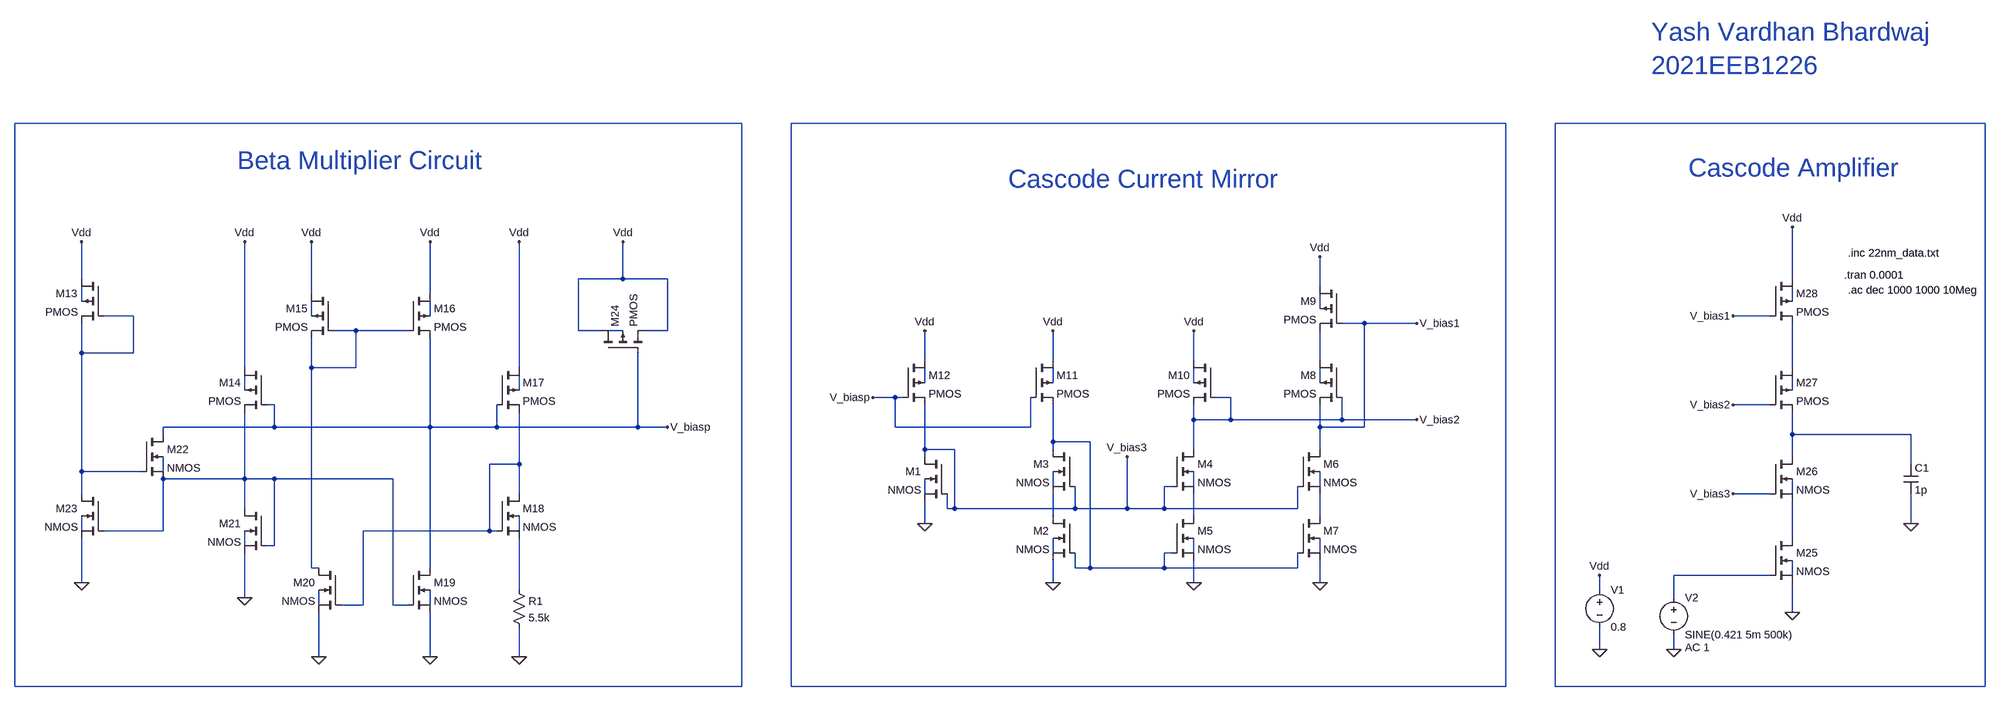
[diagram p0: schematic project_22nm.asc]
project_22nm.asc, the LTspice schematic file:
Version 4
SHEET 1 4568 820
WIRE 32 -400 -1536 -400
WIRE 1904 -400 336 -400
WIRE 3040 -400 2112 -400
WIRE -1392 -64 -1392 -144
WIRE -224 -64 -224 -144
WIRE -224 -64 -320 -64
WIRE -128 -64 -224 -64
WIRE 2624 -64 2624 -176
WIRE 1488 -48 1488 -112
WIRE -896 -32 -896 -144
WIRE -640 -32 -640 -144
WIRE -1392 -16 -1392 -48
WIRE 2624 -16 2624 -48
WIRE 1488 0 1488 -32
WIRE -1280 16 -1344 16
WIRE -896 16 -896 -16
WIRE -640 16 -640 -16
WIRE 2576 16 2496 16
WIRE 1584 32 1536 32
WIRE 1712 32 1584 32
WIRE -800 48 -848 48
WIRE -688 48 -800 48
WIRE -320 48 -320 -64
WIRE -272 48 -320 48
WIRE -224 48 -256 48
WIRE -128 48 -128 -64
WIRE -128 48 -176 48
WIRE -1392 96 -1392 32
WIRE -1280 96 -1280 16
WIRE -1280 96 -1392 96
WIRE 624 112 624 48
WIRE 912 112 912 48
WIRE 1216 112 1216 48
WIRE 1488 112 1488 48
WIRE -1040 128 -1040 -144
WIRE -896 128 -896 64
WIRE -800 128 -800 48
WIRE -800 128 -896 128
WIRE -448 128 -448 -144
WIRE 2624 128 2624 32
WIRE 624 160 624 128
WIRE 912 160 912 128
WIRE 1216 160 1216 128
WIRE 1488 160 1488 128
WIRE -1040 176 -1040 144
WIRE -448 176 -448 144
WIRE 2624 176 2624 144
WIRE 560 192 512 192
WIRE 576 192 560 192
WIRE 1296 192 1264 192
WIRE -976 208 -992 208
WIRE 2576 208 2496 208
WIRE 1216 240 1216 208
WIRE 1296 240 1296 192
WIRE 1296 240 1216 240
WIRE 1536 240 1536 192
WIRE 1536 240 1296 240
WIRE 1712 240 1536 240
WIRE -976 256 -976 208
WIRE -976 256 -1216 256
WIRE -640 256 -640 64
WIRE -640 256 -976 256
WIRE -496 256 -496 208
WIRE -496 256 -640 256
WIRE -192 256 -192 96
WIRE -192 256 -496 256
WIRE -128 256 -192 256
WIRE 560 256 560 192
WIRE 864 256 864 192
WIRE 864 256 560 256
WIRE 1488 256 1488 208
WIRE 1584 256 1584 32
WIRE 1584 256 1488 256
WIRE -1216 272 -1216 256
WIRE 2624 272 2624 224
WIRE 2880 272 2624 272
WIRE 912 288 912 208
WIRE 992 288 912 288
WIRE 624 304 624 208
WIRE 688 304 624 304
WIRE 912 304 912 288
WIRE 1216 304 1216 240
WIRE 1488 304 1488 256
WIRE 624 320 624 304
WIRE 2624 320 2624 272
WIRE -448 336 -448 224
WIRE -448 336 -512 336
WIRE 2880 336 2880 272
WIRE -1392 352 -1392 96
WIRE -1264 352 -1392 352
WIRE -1216 352 -1216 320
WIRE -1040 368 -1040 224
WIRE -1040 368 -1216 368
WIRE -976 368 -1040 368
WIRE -720 368 -976 368
WIRE 912 384 912 352
WIRE 1168 384 1152 384
WIRE 1216 384 1216 352
WIRE 1488 384 1488 352
WIRE -1392 400 -1392 352
WIRE -448 400 -448 336
WIRE 624 400 624 368
WIRE 2576 400 2496 400
WIRE 2624 400 2624 368
WIRE -1040 432 -1040 368
WIRE 672 432 672 400
WIRE 688 432 688 304
WIRE 688 432 672 432
WIRE 960 432 960 384
WIRE 960 432 688 432
WIRE 1072 432 1072 320
WIRE 1072 432 960 432
WIRE 1152 432 1152 384
WIRE 1152 432 1072 432
WIRE 1440 432 1440 384
WIRE 1440 432 1152 432
WIRE 912 448 912 400
WIRE 1216 448 1216 400
WIRE 1488 448 1488 400
WIRE 624 464 624 416
WIRE 2880 464 2880 400
WIRE -1392 480 -1392 448
WIRE -1216 480 -1216 368
WIRE -1216 480 -1344 480
WIRE -512 480 -512 336
WIRE -512 480 -784 480
WIRE -496 480 -512 480
WIRE -448 480 -448 448
WIRE 2624 496 2624 416
WIRE -1040 512 -1040 480
WIRE -976 512 -976 368
WIRE -976 512 -992 512
WIRE 912 528 912 496
WIRE 1168 528 1152 528
WIRE 1216 528 1216 496
WIRE 1488 528 1488 496
WIRE -896 560 -896 128
WIRE -880 560 -896 560
WIRE -640 560 -640 256
WIRE 960 560 960 528
WIRE 992 560 992 288
WIRE 992 560 960 560
WIRE 1152 560 1152 528
WIRE 1152 560 992 560
WIRE 1440 560 1440 528
WIRE 1440 560 1152 560
WIRE 2576 576 2368 576
WIRE 2624 576 2624 544
WIRE -1392 592 -1392 496
WIRE 912 592 912 544
WIRE 1216 592 1216 544
WIRE 1488 592 1488 544
WIRE -448 608 -448 496
WIRE 2208 608 2208 576
WIRE -1040 624 -1040 528
WIRE 2368 624 2368 576
WIRE -880 640 -880 608
WIRE -784 640 -784 480
WIRE -784 640 -832 640
WIRE -720 640 -720 368
WIRE -688 640 -720 640
WIRE -640 640 -640 608
WIRE 2624 656 2624 592
WIRE 2208 736 2208 688
WIRE 2368 736 2368 704
WIRE -880 752 -880 656
WIRE -640 752 -640 656
WIRE -448 752 -448 688
WIRE -1536 816 -1536 -400
WIRE 32 816 32 -400
WIRE 32 816 -1536 816
WIRE 336 816 336 -400
WIRE 1904 816 1904 -400
WIRE 1904 816 336 816
WIRE 2112 816 2112 -400
WIRE 3040 816 3040 -400
WIRE 3040 816 2112 816
FLAG 1488 592 0
FLAG 1216 592 0
FLAG 912 592 0
FLAG 624 464 0
FLAG 2208 736 0
FLAG 2208 576 Vdd
FLAG 624 48 Vdd
FLAG 912 48 Vdd
FLAG 1216 48 Vdd
FLAG 1488 -112 Vdd
FLAG 1712 32 V_bias1
FLAG 1712 240 V_bias2
FLAG 1072 320 V_bias3
FLAG 512 192 V_biasp
FLAG -1392 592 0
FLAG -1040 624 0
FLAG -880 752 0
FLAG -640 752 0
FLAG -448 752 0
FLAG -224 -144 Vdd
FLAG -448 -144 Vdd
FLAG -640 -144 Vdd
FLAG -896 -144 Vdd
FLAG -1040 -144 Vdd
FLAG -1392 -144 Vdd
FLAG -128 256 V_biasp
FLAG 2880 464 0
FLAG 2624 656 0
FLAG 2368 736 0
FLAG 2624 -176 Vdd
FLAG 2496 16 V_bias1
FLAG 2496 208 V_bias2
FLAG 2496 400 V_bias3
SYMBOL nmos4 672 320 M0
SYMATTR InstName M1
SYMATTR Value2 l=44n w=45.1n
SYMBOL nmos4 960 448 M0
SYMATTR InstName M2
SYMATTR Value2 l=22n w=109n
SYMBOL nmos4 960 304 M0
SYMATTR InstName M3
SYMATTR Value2 l=22n w=111n
SYMBOL nmos4 1168 304 R0
SYMATTR InstName M4
SYMATTR Value2 l=22n w=290n
SYMBOL nmos4 1168 448 R0
SYMATTR InstName M5
SYMATTR Value2 l=22n w=179n
SYMBOL nmos4 1440 304 R0
SYMATTR InstName M6
SYMATTR Value2 l=22n w=44n
SYMBOL nmos4 1440 448 R0
SYMATTR InstName M7
SYMATTR Value2 l=22n w=162.696n
SYMBOL pmos4 1536 112 M0
SYMATTR InstName M8
SYMATTR Value2 l=22n w=2200n
SYMBOL pmos4 1536 -48 M0
SYMATTR InstName M9
SYMATTR Value2 l=22n w=264n
SYMBOL pmos4 1264 112 M0
SYMATTR InstName M10
SYMATTR Value2 l=22n w=34n
SYMBOL pmos4 864 112 R0
SYMATTR InstName M11
SYMATTR Value2 l=22n w=264n
SYMBOL pmos4 576 112 R0
SYMATTR InstName M12
SYMATTR Value2 l=22n w=4400n
SYMBOL voltage 2208 592 R0
WINDOW 123 0 0 Left 0
WINDOW 39 0 0 Left 0
SYMATTR InstName V1
SYMATTR Value 0.8
SYMBOL pmos4 -1344 -64 M0
SYMATTR InstName M13
SYMATTR Value2 l=44n w=22n
SYMBOL pmos4 -992 128 M0
SYMATTR InstName M14
SYMATTR Value2 l=22n w=264n
SYMBOL pmos4 -848 -32 M0
SYMATTR InstName M15
SYMATTR Value2 l=22n w=264n
SYMBOL pmos4 -688 -32 R0
SYMATTR InstName M16
SYMATTR Value2 l=22n w=264n
SYMBOL pmos4 -496 128 R0
SYMATTR InstName M17
SYMATTR Value2 l=22n w=264n
SYMBOL nmos4 -496 400 R0
SYMATTR InstName M18
SYMATTR Value2 l=22n w=110n
SYMBOL nmos4 -688 560 R0
SYMATTR InstName M19
SYMATTR Value2 l=22n w=110n
SYMBOL nmos4 -832 560 M0
SYMATTR InstName M20
SYMATTR Value2 l=22n w=110n
SYMBOL nmos4 -992 432 M0
SYMATTR InstName M21
SYMATTR Value2 l=22n w=110n
SYMBOL nmos4 -1264 272 R0
SYMATTR InstName M22
SYMATTR Value2 l=22n w=44n
SYMBOL nmos4 -1344 400 M0
SYMATTR InstName M23
SYMATTR Value2 l=22n w=110n
SYMBOL res -464 592 R0
SYMATTR InstName R1
SYMATTR Value 5.5k
SYMBOL pmos4 -272 96 R270
SYMATTR InstName M24
SYMATTR Value2 l=22n w=22n
SYMBOL nmos4 2576 496 R0
SYMATTR InstName M25
SYMATTR Value2 l=22n w=425n
SYMBOL nmos4 2576 320 R0
SYMATTR InstName M26
SYMATTR Value2 l=132n w=1660n
SYMBOL pmos4 2576 128 R0
SYMATTR InstName M27
SYMATTR Value2 l=44n w=11000n
SYMBOL pmos4 2576 -64 R0
SYMATTR InstName M28
SYMATTR Value2 l=44n w=17000n
SYMBOL cap 2864 400 M180
WINDOW 0 24 56 Left 2
WINDOW 3 24 8 Left 2
SYMATTR InstName C1
SYMATTR Value 1p
SYMBOL voltage 2368 608 R0
WINDOW 123 24 124 Left 2
WINDOW 39 0 0 Left 0
SYMATTR Value2 AC 1
SYMATTR InstName V2
SYMATTR Value SINE(0.421 5m 500k)
TEXT -1056 -320 Left 5 ;Beta Multiplier Circuit
TEXT 816 -280 Left 5 ;Cascode Current Mirror
TEXT 2400 -304 Left 5 ;Cascode Amplifier
TEXT 2744 -120 Left 2 !.inc 22nm_data.txt
TEXT 2736 -72 Left 2 !.tran 0.0001
TEXT 2744 -40 Left 2 !.ac dec 1000 1000 10Meg
TEXT 2320 -656 Left 5 ;Yash Vardhan Bhardwaj\n2021EEB1226

The netlist it stands for:
* project_22nm.asc
M1 V_bias3 V_bias3 0 N029 NMOS l=44n w=45.1n
M2 N031 N022 0 N038 NMOS l=22n w=109n
M3 N022 V_bias3 N031 N026 NMOS l=22n w=111n
M4 V_bias2 V_bias3 N032 N027 NMOS l=22n w=290n
M5 N032 N022 0 N039 NMOS l=22n w=179n
M6 V_bias1 V_bias3 N033 N028 NMOS l=22n w=44n
M7 N033 N022 0 N040 NMOS l=22n w=162.696n
M8 N012 V_bias2 V_bias1 N017 PMOS l=22n w=2200n
M9 Vdd V_bias1 N012 N006 PMOS l=22n w=264n
M10 Vdd V_bias2 V_bias2 N016 PMOS l=22n w=34n
M11 Vdd V_biasp N022 N015 PMOS l=22n w=264n
M12 Vdd V_biasp V_bias3 N014 PMOS l=22n w=4400n
V1 Vdd 0 0.8
M13 Vdd N007 N007 N004 PMOS l=44n w=22n
M14 Vdd V_biasp N025 N018 PMOS l=22n w=264n
M15 Vdd N010 N010 N008 PMOS l=22n w=264n
M16 Vdd N010 V_biasp N009 PMOS l=22n w=264n
M17 Vdd V_biasp N023 N019 PMOS l=22n w=264n
M18 N023 N023 N043 N035 NMOS l=22n w=110n
M19 V_biasp N025 0 N045 NMOS l=22n w=110n
M20 N010 N023 0 N044 NMOS l=22n w=110n
M21 N025 N025 0 N037 NMOS l=22n w=110n
M22 V_biasp N007 N025 N024 NMOS l=22n w=44n
M23 N007 N025 0 N034 NMOS l=22n w=110n
R1 N043 0 5.5k
M24 Vdd V_biasp Vdd N011 PMOS l=22n w=22n
M25 N036 N041 0 N042 NMOS l=22n w=425n
M26 N021 V_bias3 N036 N030 NMOS l=132n w=1660n
M27 N013 V_bias2 N021 N020 PMOS l=44n w=11000n
M28 Vdd V_bias1 N013 N005 PMOS l=44n w=17000n
C1 0 N021 1p
V2 N041 0 SINE(0.421 5m 500k) AC 1
.model NMOS NMOS
.model PMOS PMOS
.lib standard.mos
* Beta Multiplier Circuit
* Cascode Current Mirror
* Cascode Amplifier
.inc 22nm_data.txt
.tran 0.0001
.ac dec 1000 1000 10Meg
* Yash Vardhan Bhardwaj
* 2021EEB1226
.backanno
.end